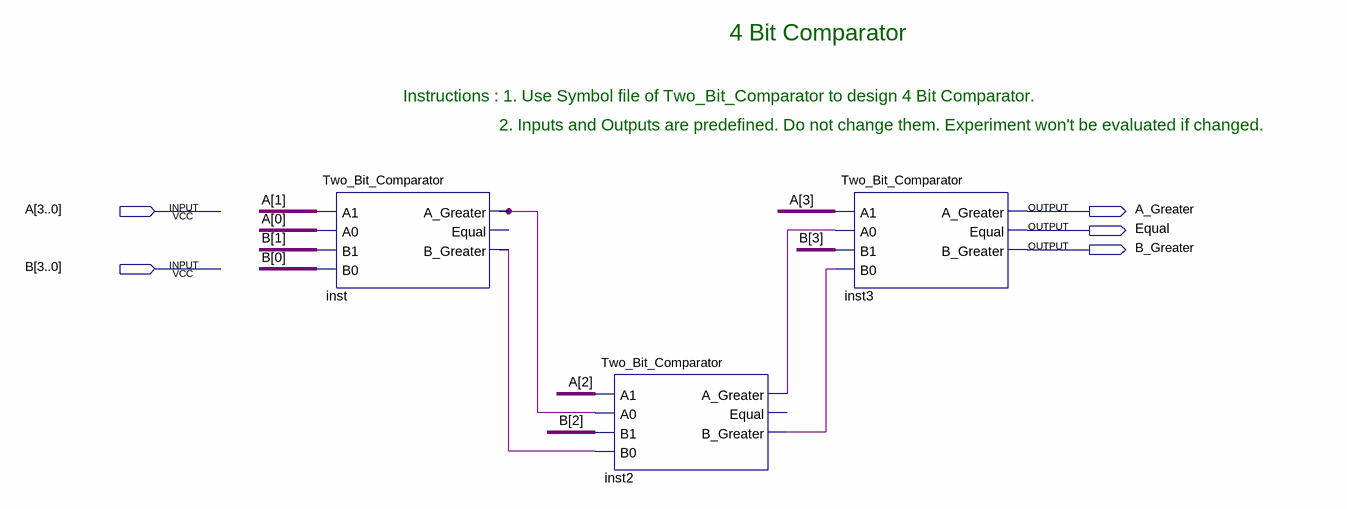
[diagram p0: schematic sheet]
// Quartus schematic Four_Bit_Comparator.bdf as structural Verilog: 3 symbols, 5 pins
module Four_Bit_Comparator (
  input  [3:0] A,
  input  [3:0] B,
  output A_Greater,
  output Equal,
  output B_Greater
);

  wire inst2_a_greater, inst2_b_greater, inst_a_greater, inst_b_greater;

  Two_Bit_Comparator inst (
    .A1(A[1]), .A0(A[0]), .B1(B[1]), .B0(B[0]), .A_Greater(inst_a_greater), .B_Greater(inst_b_greater));  // open: Equal
  Two_Bit_Comparator inst2 (
    .A1(A[2]), .A0(inst_a_greater), .B1(B[2]), .B0(inst_b_greater), .A_Greater(inst2_a_greater),
    .B_Greater(inst2_b_greater));  // open: Equal
  Two_Bit_Comparator inst3 (
    .A1(A[3]), .A0(inst2_a_greater), .B1(B[3]), .B0(inst2_b_greater), .A_Greater(A_Greater), .Equal(Equal),
    .B_Greater(B_Greater));

  // Notes on the sheet:
  //   4 Bit Comparator
  //   Instructions : 1. Use Symbol file of Two_Bit_Comparator to design 4 Bit Comparator. 
  //   2. Inputs and Outputs are predefined. Do not change them. Experiment won't be evaluated if changed.
endmodule
